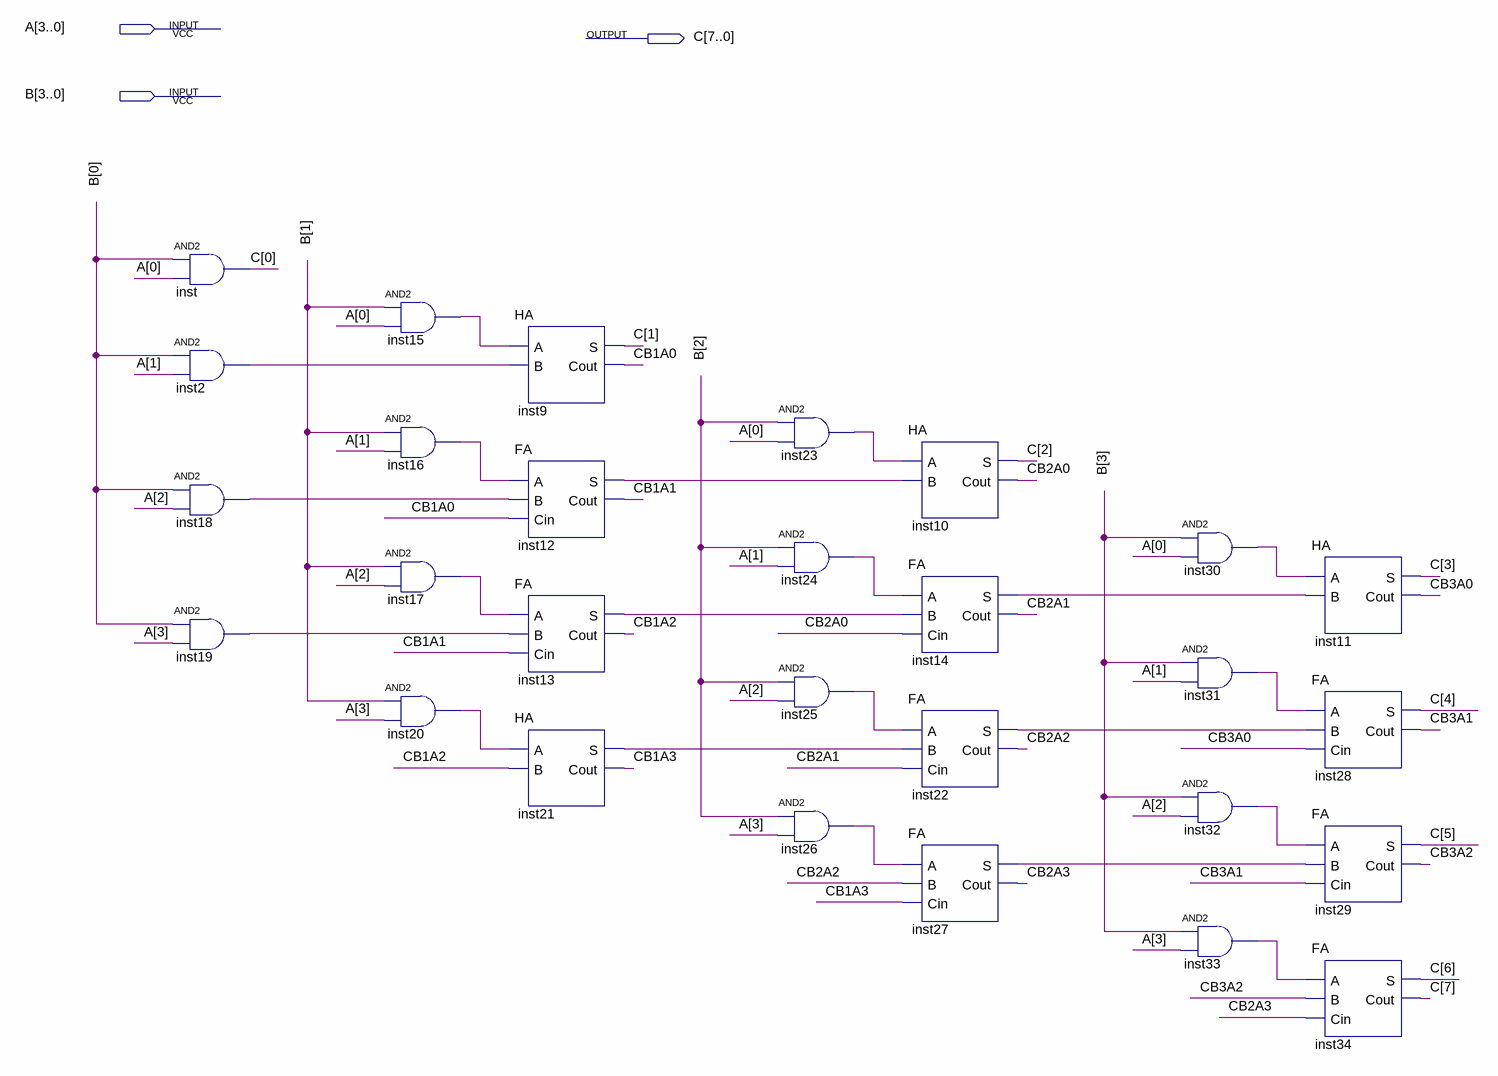
[diagram p0: schematic sheet]
// Quartus schematic MULT.bdf as structural Verilog: 28 symbols, 3 pins
module MULT (
  input  [3:0] A,
  input  [3:0] B,
  output [7:0] C
);

  wire CB1A0, CB1A1, CB1A2, CB1A3, CB2A0, CB2A1, CB2A2, CB2A3, CB3A0, CB3A1, CB3A2, inst2_out, inst12_s,
       inst13_s, inst14_s, inst15_out, inst16_out, inst17_out, inst18_out, inst19_out, inst20_out, inst21_s,
       inst22_s, inst23_out, inst24_out, inst25_out, inst26_out, inst27_s, inst30_out, inst31_out,
       inst32_out, inst33_out;

  and inst (C[0], B[0], A[0]);
  and inst2 (inst2_out, B[0], A[1]);
  and inst18 (inst18_out, B[0], A[2]);
  and inst19 (inst19_out, B[0], A[3]);
  and inst15 (inst15_out, B[1], A[0]);
  and inst16 (inst16_out, B[1], A[1]);
  and inst17 (inst17_out, B[1], A[2]);
  and inst20 (inst20_out, B[1], A[3]);
  HA inst9 (.A(inst15_out), .B(inst2_out), .S(C[1]), .Cout(CB1A0));
  FA inst12 (.A(inst16_out), .B(inst18_out), .Cin(CB1A0), .S(inst12_s), .Cout(CB1A1));
  FA inst13 (.A(inst17_out), .B(inst19_out), .Cin(CB1A1), .S(inst13_s), .Cout(CB1A2));
  HA inst21 (.A(inst20_out), .B(CB1A2), .S(inst21_s), .Cout(CB1A3));
  and inst23 (inst23_out, B[2], A[0]);
  and inst24 (inst24_out, B[2], A[1]);
  and inst25 (inst25_out, B[2], A[2]);
  and inst26 (inst26_out, B[2], A[3]);
  HA inst10 (.A(inst23_out), .B(inst12_s), .S(C[2]), .Cout(CB2A0));
  FA inst14 (.A(inst24_out), .B(inst13_s), .Cin(CB2A0), .S(inst14_s), .Cout(CB2A1));
  FA inst22 (.A(inst25_out), .B(inst21_s), .Cin(CB2A1), .S(inst22_s), .Cout(CB2A2));
  FA inst27 (.A(inst26_out), .B(CB2A2), .Cin(CB1A3), .S(inst27_s), .Cout(CB2A3));
  and inst30 (inst30_out, B[3], A[0]);
  and inst31 (inst31_out, B[3], A[1]);
  and inst32 (inst32_out, B[3], A[2]);
  and inst33 (inst33_out, B[3], A[3]);
  HA inst11 (.A(inst30_out), .B(inst14_s), .S(C[3]), .Cout(CB3A0));
  FA inst28 (.A(inst31_out), .B(inst22_s), .Cin(CB3A0), .S(C[4]), .Cout(CB3A1));
  FA inst29 (.A(inst32_out), .B(inst27_s), .Cin(CB3A1), .S(C[5]), .Cout(CB3A2));
  FA inst34 (.A(inst33_out), .B(CB3A2), .Cin(CB2A3), .S(C[6]), .Cout(C[7]));
endmodule
